# Altium schematic sheet KeyLegendreEsquematico.SchDoc
size A4
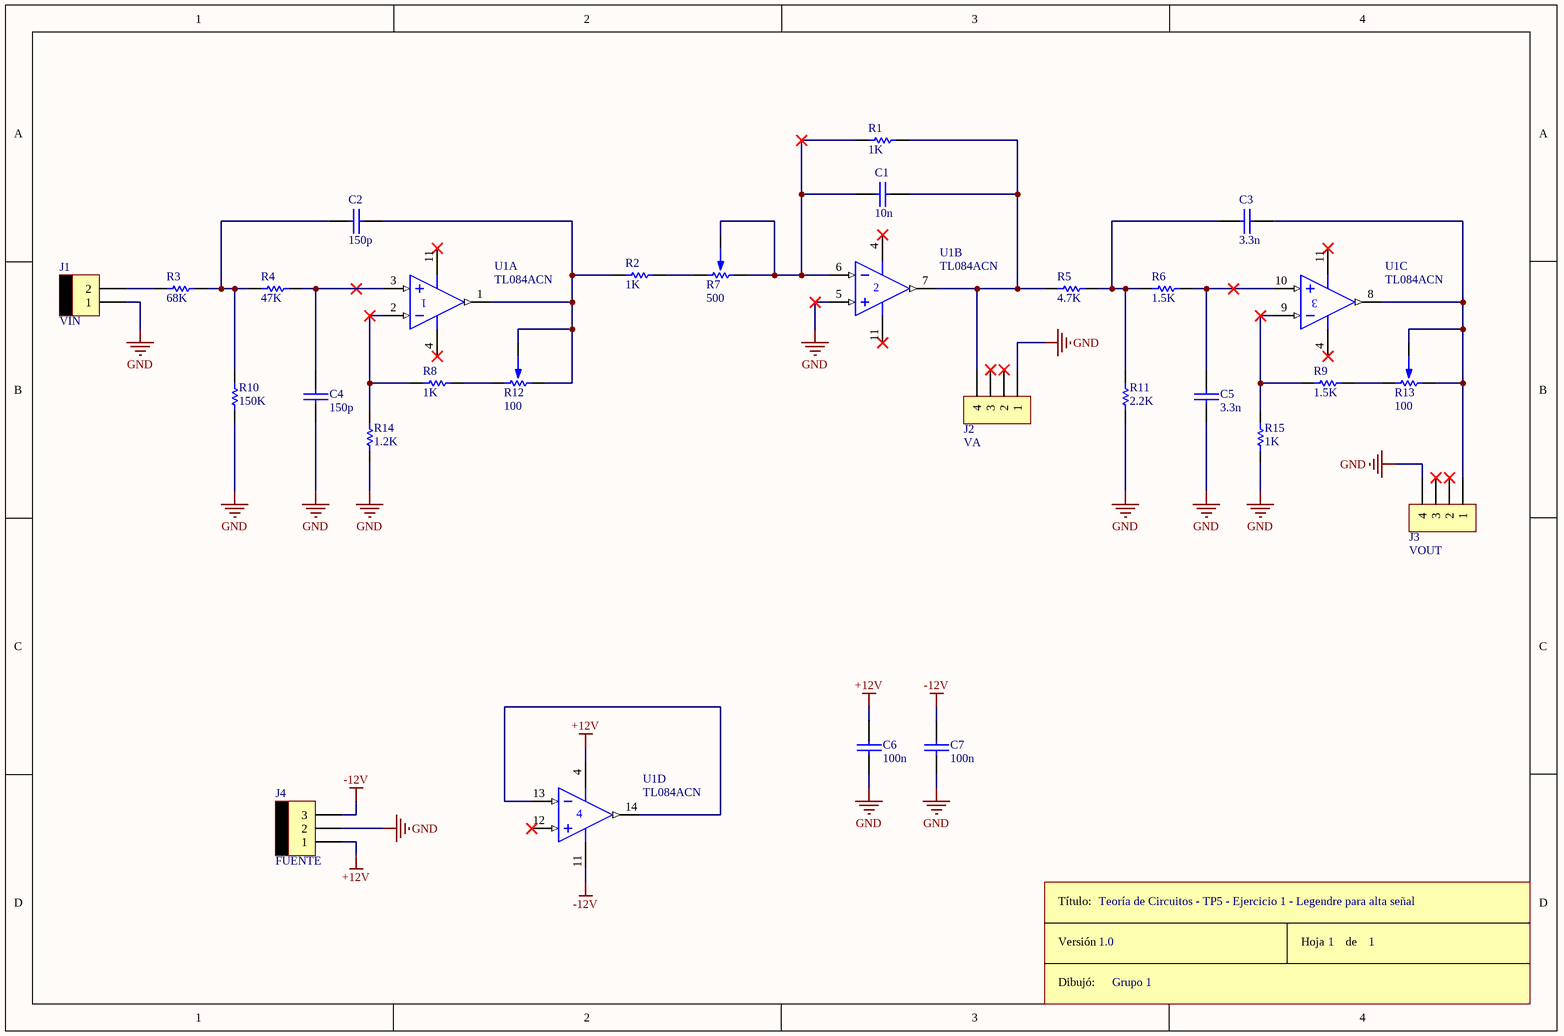
[diagram p0: KeyLegendreEsquematico.SchDoc]

## Parts
C1  10n  [CAP100]
C2  150p  [CAP100]
C3  3.3n  [CAP100]
C4  150p  [CAP100]
C5  3.3n  [CAP100]
C6  100n  [CAP100]
C7  100n  [CAP100]
J1  VIN  [MOLEX2]
J2  VA  [SIP4]
J3  VOUT  [SIP4]
J4  FUENTE  [MOLEX3]
R1  1K  [RES300]
R2  1K  [RES300]
R3  68K  [RES300]
R4  47K  [RES300]
R5  4.7K  [RES300]
R6  1.5K  [RES300]
R7  500  [PRESET V]
R8  1K  [RES300]
R9  1.5K  [RES300]
R10  150K  [RES300]
R11  2.2K  [RES300]
R12  100  [PRESET V]
R13  100  [PRESET V]
R14  1.2K  [RES300]
R15  1K  [RES300]
ROT1  Rótulo  (value not drawn)
U1  TL084ACN  [646-06]  (parts A,B,C,D of 4)

## Nets
+12V: C6.1 J4.1 U1.4(V+)
-12V: C7.1 J4.3 U1.11(V-)
GND: C4.2 C5.2 C6.2 C7.2 J1.1 J2.1 J3.4 J4.2 R10.1 R11.1 R14.1 R15.1 U1.5(IN+)
NetC1_1: C1.1 R1.1 R7.2 R7.3 U1.6(IN-)
NetC1_2: C1.2 J2.4 R1.2 R5.1 U1.7(OUT)
NetC2_1: C2.1 R3.2 R4.1 R10.2
NetC2_2: C2.2 R2.1 R12.2 R12.3 U1.1(OUT)
NetC3_1: C3.1 R5.2 R6.1 R11.2
NetC3_2: C3.2 J3.1 R13.2 R13.3 U1.8(OUT)
NetC4_1: C4.1 R4.2 U1.3(IN+)
NetC5_1: C5.1 R6.2 U1.10(IN+)
NetJ1_2: J1.2 R3.1
NetR2_2: R2.2 R7.1
NetR8_1: R8.1 R14.2 U1.2(IN-)
NetR8_2: R8.2 R12.1
NetR9_1: R9.1 R15.2 U1.9(IN-)
NetR9_2: R9.2 R13.1
NetU1_13: U1.13(IN-) U1.14(OUT)

Not connected (* = marked no-connect by the designer): J2 2* 3*; J3 2* 3*; U1 12(IN+)*

## Notes on the sheet
- Teoría de Circuitos - TP5 - Ejercicio 1 - Legendre para alta señal
- 1.0
- Grupo 1
- 1
- (in symbol Rótulo) Título:; Versión; Hoja       de; Dibujó:

## Library data of the parts
C1-C7 = CAP
J1 = MOLEX2
J2 J3 = CON4
J4 = MOLEX3
R1-R6 R8-R11 R14 R15 = RES
R7 R12 R13 = PRESET
U1 = TL084ACN: JFET-Input Operational Amplifier; Published: 17-Jul-2002; LatestRevisionDate: 06-Jun-2005; LatestRevisionNote: Stylized 3D Model Added.; DatasheetVersion: 1988; PackageVersion: 1997; PackageReference: 646-06; Publisher: Altium Limited; PackageDescription: DIP; 14 Leads; Row Spacing 7.62 mm; Pitch 2.54 mm; ComponentLink1Description: Manufacturer Link; ComponentLink1URL: http://www.onsemi.com/site/products/parametrics/0,4446,251,00.html